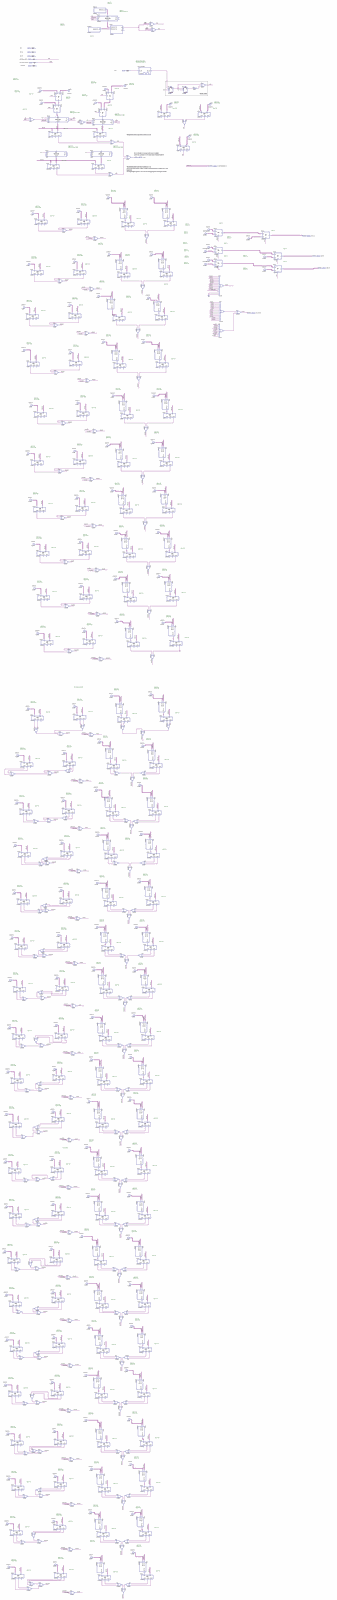
[diagram p0: schematic sheet, whole]
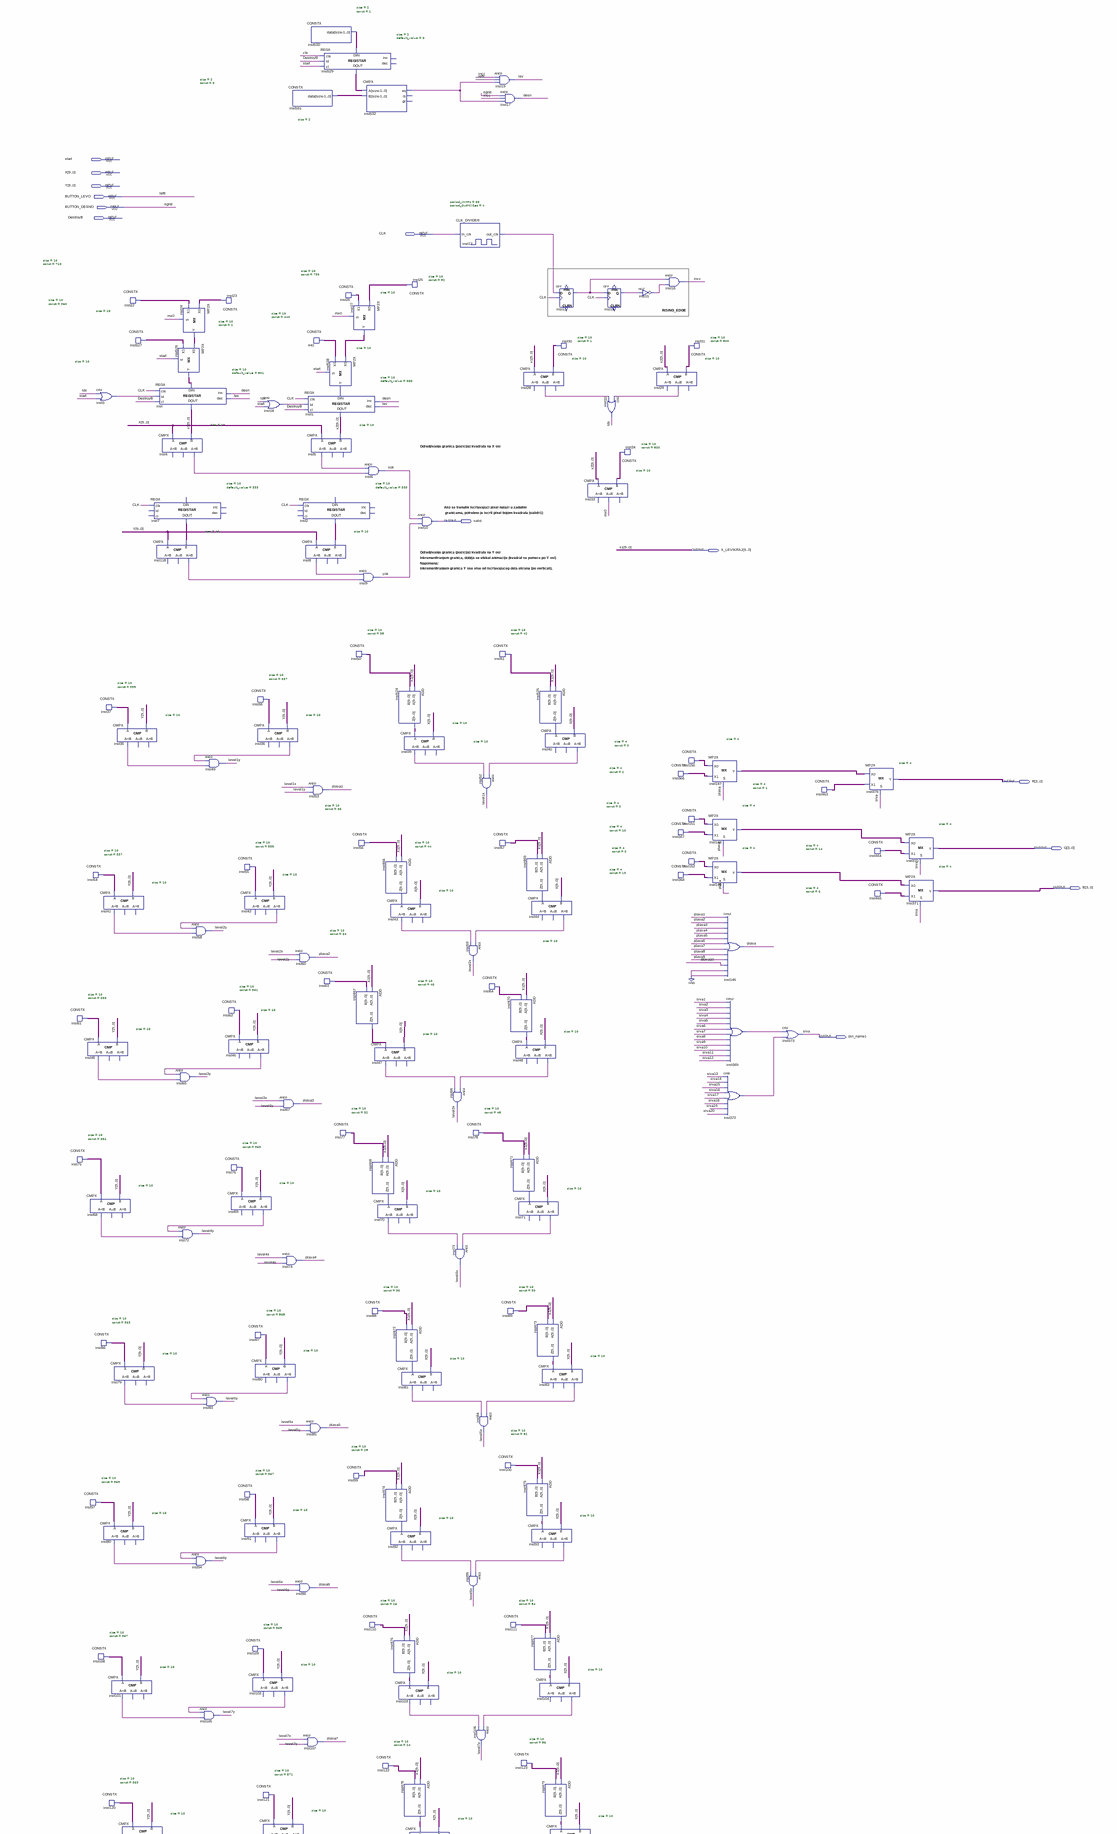
[diagram p1: schematic sheet, upper part]
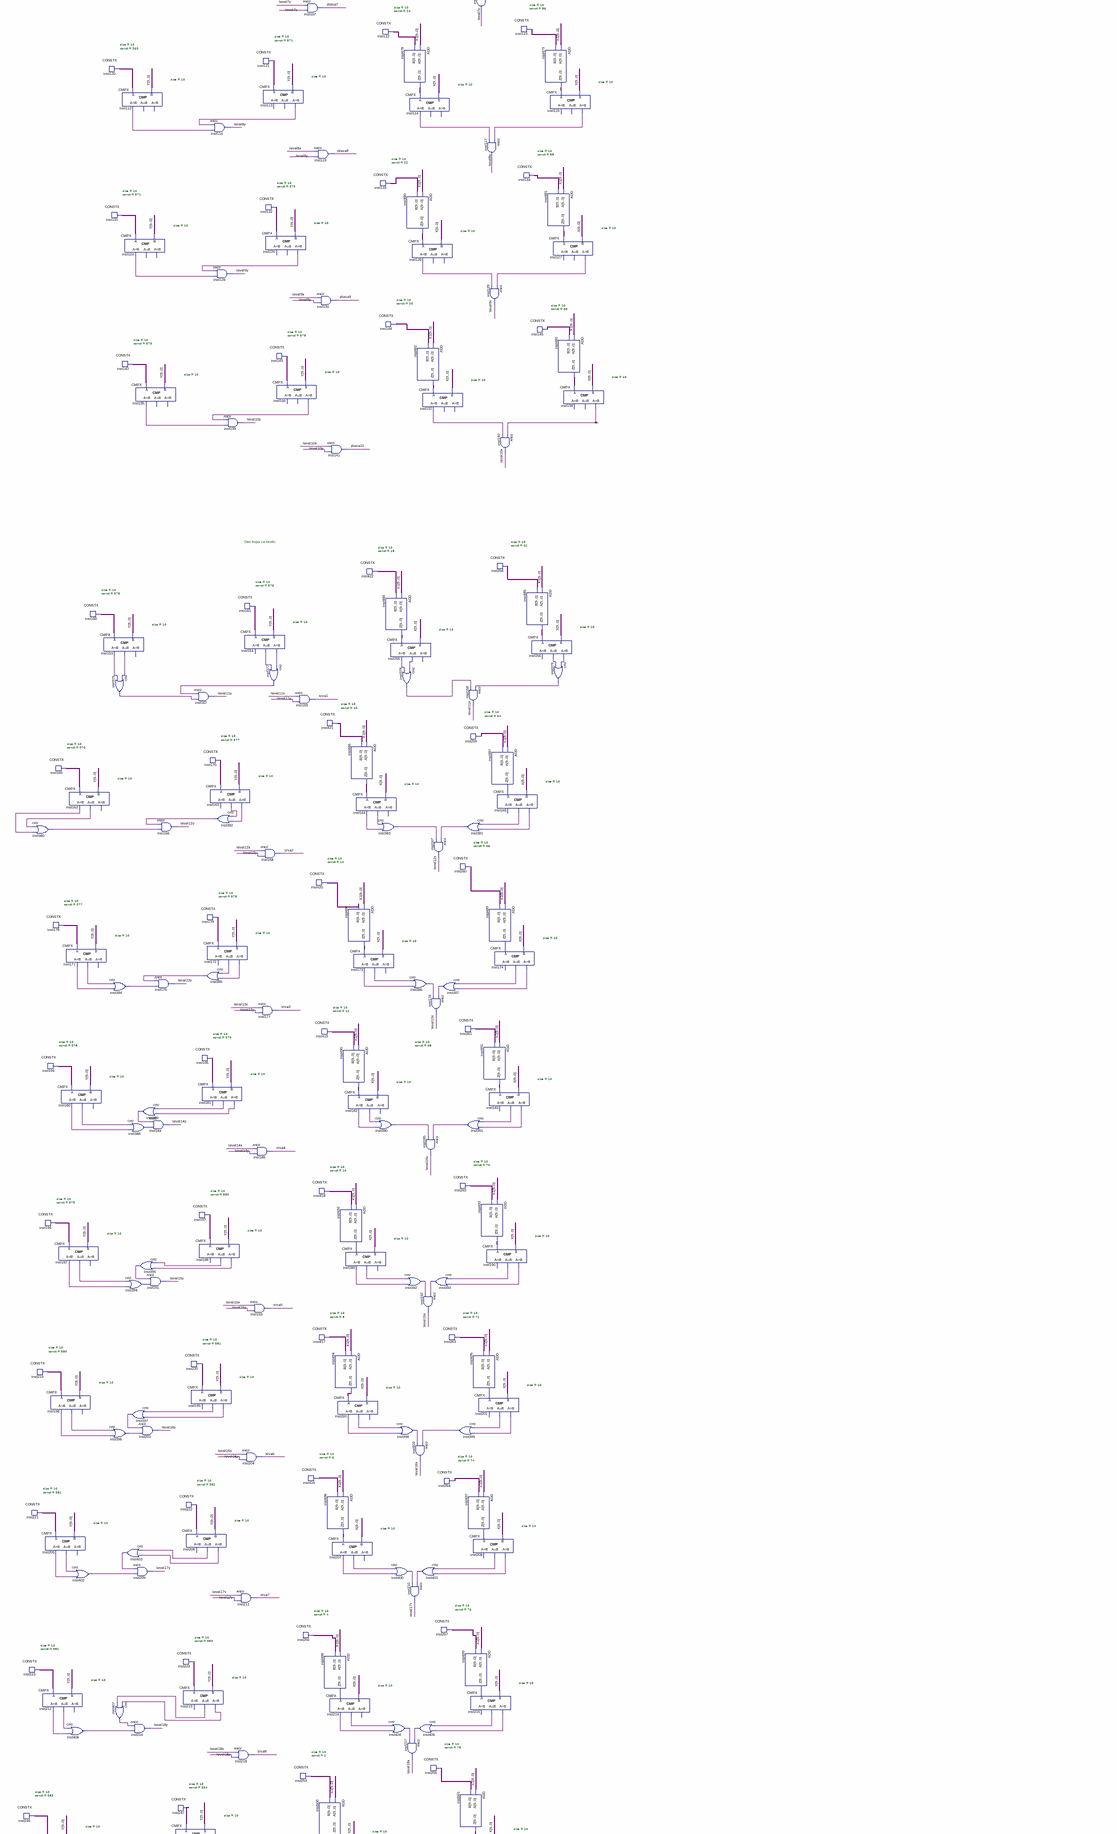
[diagram p2: schematic sheet, middle part]
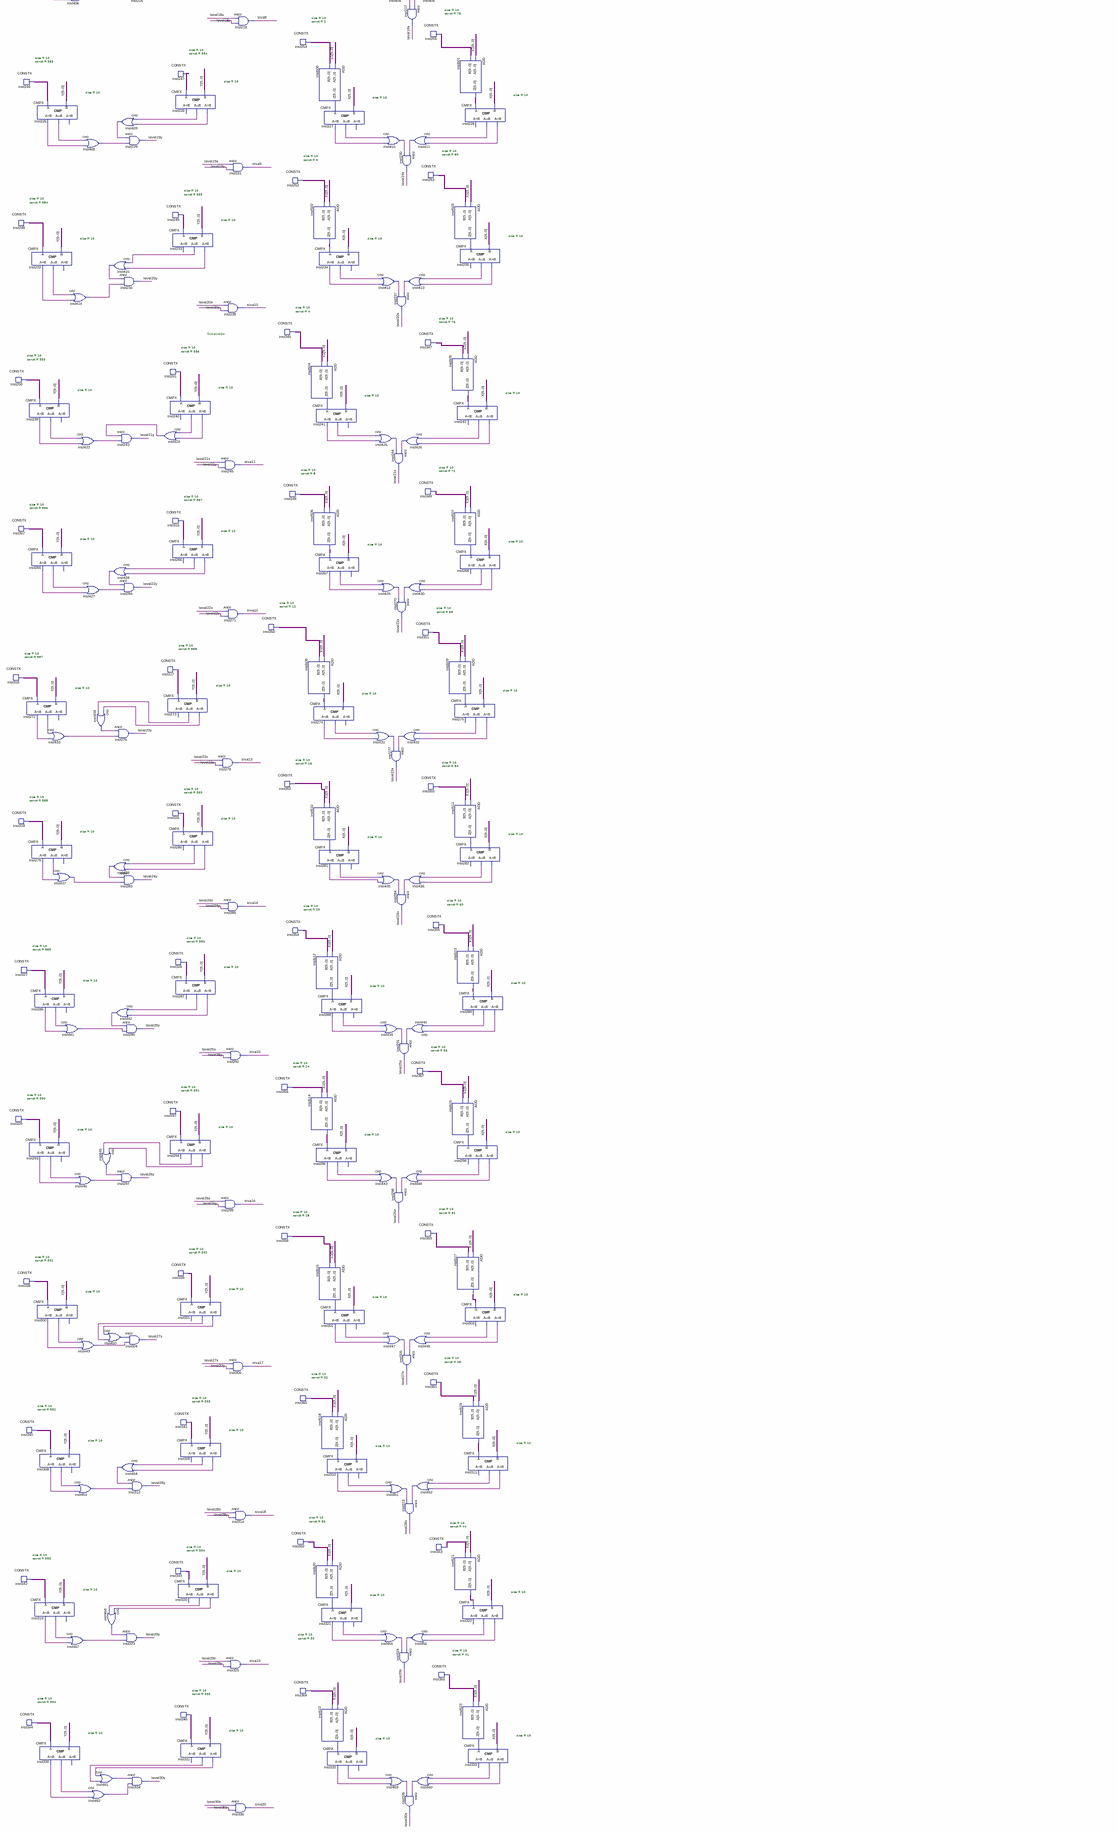
[diagram p3: schematic sheet, lower part]
// Quartus schematic Brod.bdf as structural Verilog: 530 symbols, 13 pins
module Brod (
  input  start,
  input  [9:0] X,
  input  [9:0] Y,
  input  BUTTON_LEVO,
  input  BUTTON_DESNO,
  input  DestroyB,
  input  CLK,
  output valid,
  output [9:0] X_LEVIKRAJ,
  output [3:0] R,
  output [3:0] G,
  output [3:0] B,
  output pin_name1
);

  wire desn, incc, inst3_out, inst4_gr, inst5_ls, inst8_ls, inst12_out_clk, inst13_q, inst14_q, inst15_out,
       inst18_out, inst28_eq, inst29_eq, inst35_ls, inst36_gr, inst39_ls, inst40_gr, inst41_ls, inst42_gr,
       inst43_ls, inst44_gr, inst45_ls, inst46_gr, inst47_ls, inst48_gr, inst68_ls, inst69_gr, inst70_ls,
       inst71_gr, inst79_ls, inst80_gr, inst81_ls, inst82_gr, inst90_ls, inst91_gr, inst92_ls, inst93_gr,
       inst101_ls, inst102_gr, inst103_ls, inst104_gr, inst112_ls, inst113_gr, inst114_ls, inst115_gr,
       inst118_gr, inst124_ls, inst125_gr, inst126_ls, inst127_gr, inst135_ls, inst136_gr, inst137_ls,
       inst138_gr, inst153_eq, inst153_ls, inst154_eq, inst154_gr, inst155_eq, inst155_ls, inst156_eq,
       inst156_gr, inst162_eq, inst162_ls, inst163_eq, inst163_gr, inst164_eq, inst164_ls, inst165_eq,
       inst165_gr, inst171_eq, inst171_ls, inst172_eq, inst172_gr, inst173_eq, inst173_ls, inst174_eq,
       inst174_gr, inst180_eq, inst180_ls, inst181_eq, inst181_gr, inst182_eq, inst182_ls, inst183_eq,
       inst183_gr, inst187_eq, inst187_ls, inst188_eq, inst188_gr, inst189_eq, inst189_ls, inst190_eq,
       inst190_gr, inst198_eq, inst198_ls, inst199_eq, inst199_gr, inst200_eq, inst200_ls, inst201_eq,
       inst201_gr, inst205_eq, inst205_ls, inst206_eq, inst206_gr, inst207_eq, inst207_ls, inst208_eq,
       inst208_gr, inst212_eq, inst212_ls, inst213_eq, inst213_gr, inst214_eq, inst214_ls, inst215_eq,
       inst215_gr, inst225_eq, inst225_ls, inst226_eq, inst226_gr, inst227_eq, inst227_ls, inst228_eq,
       inst228_gr, inst232_eq, inst232_ls, inst233_eq, inst233_gr, inst234_eq, inst234_ls, inst235_eq,
       inst235_gr, inst239_eq, inst239_ls, inst240_eq, inst240_gr, inst241_eq, inst241_ls, inst242_eq,
       inst242_gr, inst265_eq, inst265_ls, inst266_eq, inst266_gr, inst267_eq, inst267_ls, inst268_eq,
       inst268_gr, inst272_eq, inst272_ls, inst273_eq, inst273_gr, inst274_eq, inst274_ls, inst275_eq,
       inst275_gr, inst279_eq, inst279_ls, inst280_eq, inst280_gr, inst281_eq, inst281_ls, inst282_eq,
       inst282_gr, inst286_eq, inst286_ls, inst287_eq, inst287_gr, inst288_eq, inst288_ls, inst289_eq,
       inst289_gr, inst293_eq, inst293_ls, inst294_eq, inst294_gr, inst295_eq, inst295_ls, inst296_eq,
       inst296_gr, inst300_eq, inst300_ls, inst301_eq, inst301_gr, inst302_eq, inst302_ls, inst303_eq,
       inst303_gr, inst308_eq, inst308_ls, inst309_eq, inst309_gr, inst310_eq, inst310_ls, inst311_eq,
       inst311_gr, inst319_eq, inst319_ls, inst320_eq, inst320_gr, inst321_eq, inst321_ls, inst322_eq,
       inst322_gr, inst330_eq, inst330_ls, inst331_eq, inst331_gr, inst332_eq, inst332_ls, inst333_eq,
       inst333_gr, inst369_out, inst372_out, inst375_out, inst377_out, inst378_out, inst379_out, inst380_out,
       inst381_out, inst382_out, inst383_out, inst384_out, inst385_out, inst386_out, inst387_out,
       inst388_out, inst389_out, inst390_out, inst391_out, inst392_out, inst393_out, inst394_out,
       inst395_out, inst396_out, inst397_out, inst398_out, inst399_out, inst400_out, inst401_out,
       inst402_out, inst403_out, inst404_out, inst405_out, inst406_out, inst407_out, inst408_out,
       inst409_out, inst410_out, inst411_out, inst412_out, inst413_out, inst414_out, inst415_out,
       inst423_out, inst424_out, inst425_out, inst426_out, inst427_out, inst428_out, inst429_out,
       inst430_out, inst431_out, inst432_out, inst433_out, inst434_out, inst435_out, inst436_out,
       inst437_out, inst438_out, inst439_out, inst440_out, inst441_out, inst442_out, inst443_out,
       inst444_out, inst445_out, inst446_out, inst447_out, inst448_out, inst449_out, inst450_out,
       inst451_out, inst452_out, inst453_out, inst454_out, inst455_out, inst456_out, inst457_out,
       inst458_out, inst459_out, inst460_out, inst461_out, inst462_out, inst532_eq, ldx, lev, level1x,
       level1y, level2x, level2y, level3x, level3y, level4x, level4y, level5x, level5y, level6x, level6y,
       level7x, level7y, level8x, level8y, level9x, level9y, level10x, level10y, level11x, level11y,
       level12x, level12y, level13x, level13y, level14x, level14y, level15x, level15y, level16x, level16y,
       level17x, level17y, level18x, level18y, level19x, level19y, level20x, level20y, level21x, level21y,
       level22x, level22y, level23x, level23y, level24x, level24y, level25x, level25y, level26x, level26y,
       level27x, level27y, level28x, level28y, level29x, level29y, level30x, level30y, mx0, plava, plava1,
       plava2, plava3, plava4, plava5, plava6, plava7, plava8, plava9, plava10, siva1, siva2, siva3, siva4,
       siva5, siva6, siva7, siva8, siva9, siva10, siva11, siva12, siva13, siva14, siva15, siva16, siva17,
       siva18, siva19, siva20, xok, yok;
  wire [1:0] inst529_data_out, inst530_data, inst531_data;
  wire [3:0] inst147_y, inst148_y, inst149_y, inst150_data, inst151_data, inst152_data, inst366_data,
       inst367_data, inst368_data, inst463_data, inst464_data, inst465_data;
  wire [9:0] inst2_data_out, inst7_data_out, inst22_data, inst23_data, inst24_y, inst25_data, inst26_data,
       inst27_y, inst30_data, inst31_data, inst34_data, inst37_data, inst38_data, inst50_data, inst51_data,
       inst54_data, inst55_data, inst56_data, inst57_data, inst61_data, inst62_data, inst63_data,
       inst64_data, inst75_data, inst76_data, inst77_data, inst78_data, inst86_data, inst87_data,
       inst88_data, inst89_data, inst97_data, inst98_data, inst99_data, inst100_data, inst108_data,
       inst109_data, inst110_data, inst111_data, inst120_data, inst121_data, inst122_data, inst123_data,
       inst131_data, inst132_data, inst133_data, inst134_data, inst142_data, inst143_data, inst144_data,
       inst145_data, inst160_data, inst161_data, inst169_data, inst170_data, inst178_data, inst179_data,
       inst194_data, inst195_data, inst196_data, inst197_data, inst219_data, inst220_data, inst221_data,
       inst222_data, inst223_data, inst224_data, inst246_data, inst247_data, inst248_data, inst249_data,
       inst250_data, inst251_data, inst252_data, inst253_data, inst254_data, inst255_data, inst256_data,
       inst257_data, inst258_data, inst259_data, inst260_data, inst261_data, inst262_data, inst263_data,
       inst264_data, inst307_data, inst315_data, inst316_data, inst317_data, inst318_data, inst326_data,
       inst327_data, inst328_data, inst329_data, inst337_data, inst338_data, inst339_data, inst340_data,
       inst341_data, inst342_data, inst343_data, inst344_data, inst345_data, inst346_data, inst347_data,
       inst348_data, inst349_data, inst350_data, inst351_data, inst352_data, inst353_data, inst354_data,
       inst355_data, inst356_data, inst357_data, inst358_data, inst359_data, inst360_data, inst361_data,
       inst362_data, inst363_data, inst364_data, inst365_data, inst416_data, inst417_data, inst418_data,
       inst419_data, inst420_data, inst421_data, inst422_data, inst466_z, inst467_z, inst468_z, inst469_z,
       inst470_z, inst471_z, inst472_z, inst473_z, inst474_z, inst475_z, inst476_z, inst477_z, inst478_z,
       inst479_z, inst480_z, inst481_z, inst482_z, inst483_z, inst484_z, inst485_z, inst486_z, inst487_z,
       inst488_z, inst489_z, inst490_z, inst491_z, inst492_z, inst493_z, inst494_z, inst495_z, inst496_z,
       inst497_z, inst498_z, inst499_z, inst500_z, inst501_z, inst502_z, inst503_z, inst504_z, inst505_z,
       inst506_z, inst507_z, inst508_z, inst509_z, inst510_z, inst511_z, inst512_z, inst513_z, inst514_z,
       inst515_z, inst516_z, inst517_z, inst518_z, inst519_z, inst520_z, inst521_z, inst522_z, inst523_z,
       inst524_z, inst525_z, inst526_y, inst527_data, inst528_y, n440_data, x2;

  CONSTX #(.size(10), .\const (583)) inst246 (.data(inst246_data));
  CONSTX #(.size(10), .\const (584)) inst248 (.data(inst248_data));
  CONSTX #(.size(10), .\const (585)) inst250 (.data(inst250_data));
  CONSTX #(.size(10), .\const (586)) inst307 (.data(inst307_data));
  CONSTX #(.size(10), .\const (587)) inst316 (.data(inst316_data));
  CONSTX #(.size(10), .\const (588)) inst318 (.data(inst318_data));
  CONSTX #(.size(10), .\const (589)) inst327 (.data(inst327_data));
  CONSTX #(.size(10), .\const (590)) inst329 (.data(inst329_data));
  CONSTX #(.size(10), .\const (591)) inst338 (.data(inst338_data));
  CONSTX #(.size(10), .\const (592)) inst340 (.data(inst340_data));
  CONSTX #(.size(10), .\const (593)) inst342 (.data(inst342_data));
  CONSTX #(.size(10), .\const (594)) inst344 (.data(inst344_data));
  or inst380 (inst380_out, inst162_eq, inst162_ls);
  CONSTX #(.size(10), .\const (578)) inst194 (.data(inst194_data));
  CONSTX #(.size(10), .\const (579)) inst196 (.data(inst196_data));
  CONSTX #(.size(10), .\const (580)) inst219 (.data(inst219_data));
  CONSTX #(.size(10), .\const (581)) inst221 (.data(inst221_data));
  CMPX #(.size(10)) inst205 (.A(inst221_data), .B(Y), .ls(inst205_ls), .eq(inst205_eq));  // open: gr
  CONSTX #(.size(10), .\const (582)) inst223 (.data(inst223_data));
  CMPX #(.size(10)) inst212 (.A(inst223_data), .B(Y), .ls(inst212_ls), .eq(inst212_eq));  // open: gr
  CMPX #(.size(10)) inst225 (.A(inst246_data), .B(Y), .ls(inst225_ls), .eq(inst225_eq));  // open: gr
  CMPX #(.size(10)) inst232 (.A(inst248_data), .B(Y), .ls(inst232_ls), .eq(inst232_eq));  // open: gr
  CMPX #(.size(10)) inst239 (.A(inst250_data), .B(Y), .ls(inst239_ls), .eq(inst239_eq));  // open: gr
  CMPX #(.size(10)) inst265 (.A(inst307_data), .B(Y), .ls(inst265_ls), .eq(inst265_eq));  // open: gr
  CMPX #(.size(10)) inst272 (.A(inst316_data), .B(Y), .ls(inst272_ls), .eq(inst272_eq));  // open: gr
  CMPX #(.size(10)) inst279 (.A(inst318_data), .B(Y), .ls(inst279_ls), .eq(inst279_eq));  // open: gr
  CMPX #(.size(10)) inst286 (.A(inst327_data), .B(Y), .ls(inst286_ls), .eq(inst286_eq));  // open: gr
  CMPX #(.size(10)) inst293 (.A(inst329_data), .B(Y), .ls(inst293_ls), .eq(inst293_eq));  // open: gr
  CMPX #(.size(10)) inst300 (.A(inst338_data), .B(Y), .ls(inst300_ls), .eq(inst300_eq));  // open: gr
  CMPX #(.size(10)) inst308 (.A(inst340_data), .B(Y), .ls(inst308_ls), .eq(inst308_eq));  // open: gr
  CMPX #(.size(10)) inst319 (.A(inst342_data), .B(Y), .ls(inst319_ls), .eq(inst319_eq));  // open: gr
  CMPX #(.size(10)) inst330 (.A(inst344_data), .B(Y), .ls(inst330_ls), .eq(inst330_eq));  // open: gr
  CONSTX #(.size(10), .\const (576)) inst169 (.data(inst169_data));
  CONSTX #(.size(10), .\const (577)) inst178 (.data(inst178_data));
  CMPX #(.size(10)) inst171 (.A(inst178_data), .B(Y), .ls(inst171_ls), .eq(inst171_eq));  // open: gr
  CMPX #(.size(10)) inst180 (.A(inst194_data), .B(Y), .ls(inst180_ls), .eq(inst180_eq));  // open: gr
  CMPX #(.size(10)) inst187 (.A(inst196_data), .B(Y), .ls(inst187_ls), .eq(inst187_eq));  // open: gr
  CMPX #(.size(10)) inst198 (.A(inst219_data), .B(Y), .ls(inst198_ls), .eq(inst198_eq));  // open: gr
  or inst433 (inst433_out, inst272_eq, inst272_ls);
  or inst437 (inst437_out, inst279_eq, inst279_ls);
  or inst441 (inst441_out, inst286_eq, inst286_ls);
  CONSTX #(.size(10), .\const (559)) inst61 (.data(inst61_data));
  CMPX #(.size(10)) inst45 (.A(inst61_data), .B(Y), .ls(inst45_ls));  // open: eq, gr
  CONSTX #(.size(10), .\const (561)) inst75 (.data(inst75_data));
  CONSTX #(.size(10), .\const (565)) inst97 (.data(inst97_data));
  CONSTX #(.size(10), .\const (575)) inst160 (.data(inst160_data));
  CMPX #(.size(10)) inst162 (.A(inst169_data), .B(Y), .ls(inst162_ls), .eq(inst162_eq));  // open: gr
  or inst402 (inst402_out, inst205_eq, inst205_ls);
  or inst406 (inst406_out, inst212_eq, inst212_ls);
  or inst408 (inst408_out, inst225_eq, inst225_ls);
  or inst414 (inst414_out, inst232_eq, inst232_ls);
  or inst423 (inst423_out, inst239_eq, inst239_ls);
  or inst427 (inst427_out, inst265_eq, inst265_ls);
  or inst446 (inst446_out, inst293_eq, inst293_ls);
  or inst449 (inst449_out, inst300_eq, inst300_ls);
  or inst453 (inst453_out, inst308_eq, inst308_ls);
  or inst457 (inst457_out, inst319_eq, inst319_ls);
  or inst3 (inst3_out, ldx, start);
  CONSTX #(.size(10), .\const (555)) inst37 (.data(inst37_data));
  CONSTX #(.size(10), .\const (557)) inst54 (.data(inst54_data));
  CMPX #(.size(10)) inst41 (.A(inst54_data), .B(Y), .ls(inst41_ls));  // open: eq, gr
  CMPX #(.size(10)) inst68 (.A(inst75_data), .B(Y), .ls(inst68_ls));  // open: eq, gr
  CONSTX #(.size(10), .\const (563)) inst86 (.data(inst86_data));
  CMPX #(.size(10)) inst90 (.A(inst97_data), .B(Y), .ls(inst90_ls));  // open: eq, gr
  CONSTX #(.size(10), .\const (567)) inst108 (.data(inst108_data));
  CONSTX #(.size(10), .\const (569)) inst120 (.data(inst120_data));
  CONSTX #(.size(10), .\const (571)) inst131 (.data(inst131_data));
  CMPX #(.size(10)) inst153 (.A(inst160_data), .B(Y), .ls(inst153_ls), .eq(inst153_eq));  // open: gr
  or inst434 (inst434_out, inst273_gr, inst273_eq);
  or inst445 (inst445_out, inst294_gr, inst294_eq);
  or inst450 (inst450_out, inst301_gr, inst301_eq);
  or inst458 (inst458_out, inst320_gr, inst320_eq);
  or inst461 (inst461_out, inst331_gr, inst331_eq);
  or inst462 (inst462_out, inst330_eq, inst330_ls);
  CONSTX #(.size(10), .\const (719)) inst22 (.data(inst22_data));
  CMPX #(.size(10)) inst35 (.A(inst37_data), .B(Y), .ls(inst35_ls));  // open: eq, gr
  CMPX #(.size(10)) inst79 (.A(inst86_data), .B(Y), .ls(inst79_ls));  // open: eq, gr
  CMPX #(.size(10)) inst101 (.A(inst108_data), .B(Y), .ls(inst101_ls));  // open: eq, gr
  CMPX #(.size(10)) inst112 (.A(inst120_data), .B(Y), .ls(inst112_ls));  // open: eq, gr
  CMPX #(.size(10)) inst124 (.A(inst131_data), .B(Y), .ls(inst124_ls));  // open: eq, gr
  CONSTX #(.size(10), .\const (573)) inst142 (.data(inst142_data));
  or inst375 (inst375_out, inst153_eq, inst153_ls);
  or inst384 (inst384_out, inst171_eq, inst171_ls);
  or inst394 (inst394_out, inst187_eq, inst187_ls);
  or inst396 (inst396_out, inst198_eq, inst198_ls);
  or inst403 (inst403_out, inst206_eq, inst206_gr);
  or inst407 (inst407_out, inst213_gr, inst213_eq);
  or inst409 (inst409_out, inst226_eq, inst226_gr);
  and inst229 (level19y, inst409_out, inst408_out);
  or inst415 (inst415_out, inst233_eq, inst233_gr);
  and inst236 (level20y, inst415_out, inst414_out);
  and inst243 (level21y, inst424_out, inst423_out);
  or inst428 (inst428_out, inst266_eq, inst266_gr);
  and inst269 (level22y, inst428_out, inst427_out);
  and inst276 (level23y, inst434_out, inst433_out);
  or inst438 (inst438_out, inst280_eq, inst280_gr);
  and inst283 (level24y, inst438_out, inst437_out);
  or inst442 (inst442_out, inst287_eq, inst287_gr);
  and inst290 (level25y, inst442_out, inst441_out);
  and inst297 (level26y, inst445_out, inst446_out);
  and inst304 (level27y, inst450_out, inst449_out);
  or inst454 (inst454_out, inst309_eq, inst309_gr);
  and inst323 (level29y, inst458_out, inst457_out);
  CONSTX #(.size(10), .\const (360)) inst527 (.data(inst527_data));
  CMPX #(.size(10)) inst135 (.A(inst142_data), .B(Y), .ls(inst135_ls));  // open: eq, gr
  or inst389 (inst389_out, inst181_eq, inst181_gr);
  or inst388 (inst388_out, inst180_eq, inst180_ls);
  or inst395 (inst395_out, inst188_eq, inst188_gr);
  and inst191 (level15y, inst395_out, inst394_out);
  or inst397 (inst397_out, inst199_eq, inst199_gr);
  and inst202 (level16y, inst397_out, inst396_out);
  and inst209 (level17y, inst403_out, inst402_out);
  and inst216 (level18y, inst407_out, inst406_out);
  and inst312 (level28y, inst454_out, inst453_out);
  and inst334 (level30y, inst461_out, inst462_out);
  REGX #(.size(10), .default_value(801)) inst (
    .clk(CLK), .ld(inst3_out), .cl(DestroyB), .inc(desn), .dec(lev), .data_in(inst526_y),
    .data_out(X_LEVIKRAJ));
  CMPX #(.size(10)) inst4 (.A(X), .B(X_LEVIKRAJ), .gr(inst4_gr));  // open: ls, eq
  REGX #(.size(10), .default_value(555)) inst7 (
    .clk(CLK), .data_out(inst7_data_out));  // open: ld, cl, inc, dec, data_in
  CMPX #(.size(10)) inst118 (.A(Y), .B(inst7_data_out), .gr(inst118_gr));  // open: ls, eq
  and inst166 (level12y, inst382_out, inst380_out);
  and inst175 (level13y, inst385_out, inst384_out);
  and inst184 (level14y, inst389_out, inst388_out);
  CONSTX #(.size(10), .\const (585)) inst249 (.data(inst249_data));
  CMPX #(.size(10)) inst233 (.A(inst249_data), .B(Y), .eq(inst233_eq), .gr(inst233_gr));  // open: ls
  CONSTX #(.size(10), .\const (586)) inst251 (.data(inst251_data));
  CMPX #(.size(10)) inst240 (.A(inst251_data), .B(Y), .eq(inst240_eq), .gr(inst240_gr));  // open: ls
  or inst424 (inst424_out, inst240_eq, inst240_gr);
  CONSTX #(.size(10), .\const (587)) inst315 (.data(inst315_data));
  CMPX #(.size(10)) inst266 (.A(inst315_data), .B(Y), .eq(inst266_eq), .gr(inst266_gr));  // open: ls
  CONSTX #(.size(10), .\const (588)) inst317 (.data(inst317_data));
  CMPX #(.size(10)) inst273 (.A(inst317_data), .B(Y), .eq(inst273_eq), .gr(inst273_gr));  // open: ls
  CONSTX #(.size(10), .\const (589)) inst326 (.data(inst326_data));
  CMPX #(.size(10)) inst280 (.A(inst326_data), .B(Y), .eq(inst280_eq), .gr(inst280_gr));  // open: ls
  CONSTX #(.size(10), .\const (590)) inst328 (.data(inst328_data));
  CONSTX #(.size(10), .\const (591)) inst337 (.data(inst337_data));
  CMPX #(.size(10)) inst294 (.A(inst337_data), .B(Y), .eq(inst294_eq), .gr(inst294_gr));  // open: ls
  CONSTX #(.size(10), .\const (594)) inst343 (.data(inst343_data));
  MP2X #(.size(10)) inst24 (.S(mx0), .X0(inst23_data), .X1(inst22_data), .Y(inst24_y));
  MP2X #(.size(10)) inst526 (.S(start), .X0(inst24_y), .X1(inst527_data), .Y(inst526_y));
  and inst65 (level3y, inst46_gr, inst45_ls);
  and inst72 (level4y, inst69_gr, inst68_ls);
  CONSTX #(.size(10), .\const (581)) inst220 (.data(inst220_data));
  CMPX #(.size(10)) inst199 (.A(inst220_data), .B(Y), .eq(inst199_eq), .gr(inst199_gr));  // open: ls
  CONSTX #(.size(10), .\const (582)) inst222 (.data(inst222_data));
  CMPX #(.size(10)) inst206 (.A(inst222_data), .B(Y), .eq(inst206_eq), .gr(inst206_gr));  // open: ls
  CONSTX #(.size(10), .\const (583)) inst224 (.data(inst224_data));
  CMPX #(.size(10)) inst213 (.A(inst224_data), .B(Y), .eq(inst213_eq), .gr(inst213_gr));  // open: ls
  CONSTX #(.size(10), .\const (584)) inst247 (.data(inst247_data));
  CMPX #(.size(10)) inst226 (.A(inst247_data), .B(Y), .eq(inst226_eq), .gr(inst226_gr));  // open: ls
  CMPX #(.size(10)) inst287 (.A(inst328_data), .B(Y), .eq(inst287_eq), .gr(inst287_gr));  // open: ls
  CONSTX #(.size(10), .\const (592)) inst339 (.data(inst339_data));
  CMPX #(.size(10)) inst301 (.A(inst339_data), .B(Y), .eq(inst301_eq), .gr(inst301_gr));  // open: ls
  CONSTX #(.size(10), .\const (593)) inst341 (.data(inst341_data));
  CMPX #(.size(10)) inst309 (.A(inst341_data), .B(Y), .eq(inst309_eq), .gr(inst309_gr));  // open: ls
  CMPX #(.size(10)) inst320 (.A(inst343_data), .B(Y), .eq(inst320_eq), .gr(inst320_gr));  // open: ls
  CONSTX #(.size(10), .\const (595)) inst345 (.data(inst345_data));
  CMPX #(.size(10)) inst331 (.A(inst345_data), .B(Y), .eq(inst331_eq), .gr(inst331_gr));  // open: ls
  and inst49 (level1y, inst36_gr, inst35_ls);
  and inst58 (level2y, inst42_gr, inst41_ls);
  and inst83 (level5y, inst80_gr, inst79_ls);
  and inst94 (level6y, inst91_gr, inst90_ls);
  and inst105 (level7y, inst102_gr, inst101_ls);
  and inst116 (level8y, inst113_gr, inst112_ls);
  and inst157 (level11y, inst377_out, inst375_out);
  CONSTX #(.size(10), .\const (577)) inst170 (.data(inst170_data));
  CMPX #(.size(10)) inst163 (.A(inst170_data), .B(Y), .eq(inst163_eq), .gr(inst163_gr));  // open: ls
  CONSTX #(.size(10), .\const (578)) inst179 (.data(inst179_data));
  CMPX #(.size(10)) inst172 (.A(inst179_data), .B(Y), .eq(inst172_eq), .gr(inst172_gr));  // open: ls
  or inst385 (inst385_out, inst172_eq, inst172_gr);
  CONSTX #(.size(10), .\const (579)) inst195 (.data(inst195_data));
  CMPX #(.size(10)) inst181 (.A(inst195_data), .B(Y), .eq(inst181_eq), .gr(inst181_gr));  // open: ls
  CONSTX #(.size(10), .\const (580)) inst197 (.data(inst197_data));
  CMPX #(.size(10)) inst188 (.A(inst197_data), .B(Y), .eq(inst188_eq), .gr(inst188_gr));  // open: ls
  CONSTX #(.size(10), .\const (2)) inst23 (.data(inst23_data));
  CONSTX #(.size(10), .\const (561)) inst62 (.data(inst62_data));
  CMPX #(.size(10)) inst46 (.A(inst62_data), .B(Y), .gr(inst46_gr));  // open: ls, eq
  CONSTX #(.size(10), .\const (563)) inst76 (.data(inst76_data));
  CMPX #(.size(10)) inst69 (.A(inst76_data), .B(Y), .gr(inst69_gr));  // open: ls, eq
  and inst128 (level9y, inst125_gr, inst124_ls);
  and inst139 (level10y, inst136_gr, inst135_ls);
  or inst382 (inst382_out, inst163_eq, inst163_gr);
  and inst231 (siva9, level19x, level19y);
  and inst238 (siva10, level20x, level20y);
  and inst245 (siva11, level21x, level21y);
  and inst271 (siva12, level22x, level22y);
  and inst278 (siva13, level23x, level23y);
  and inst285 (siva14, level24x, level24y);
  and inst292 (siva15, level25x, level25y);
  and inst299 (siva16, level26x, level26y);
  and inst306 (siva17, level27x, level27y);
  and inst314 (siva18, level28x, level28y);
  and inst325 (siva19, level29x, level29y);
  and inst336 (siva20, level30x, level30y);
  CONSTX #(.size(10), .\const (557)) inst38 (.data(inst38_data));
  CMPX #(.size(10)) inst36 (.A(inst38_data), .B(Y), .gr(inst36_gr));  // open: ls, eq
  CONSTX #(.size(10), .\const (559)) inst55 (.data(inst55_data));
  CMPX #(.size(10)) inst42 (.A(inst55_data), .B(Y), .gr(inst42_gr));  // open: ls, eq
  CONSTX #(.size(10), .\const (565)) inst87 (.data(inst87_data));
  CMPX #(.size(10)) inst80 (.A(inst87_data), .B(Y), .gr(inst80_gr));  // open: ls, eq
  CONSTX #(.size(10), .\const (567)) inst98 (.data(inst98_data));
  CMPX #(.size(10)) inst91 (.A(inst98_data), .B(Y), .gr(inst91_gr));  // open: ls, eq
  CONSTX #(.size(10), .\const (569)) inst109 (.data(inst109_data));
  CMPX #(.size(10)) inst102 (.A(inst109_data), .B(Y), .gr(inst102_gr));  // open: ls, eq
  CONSTX #(.size(10), .\const (576)) inst161 (.data(inst161_data));
  CMPX #(.size(10)) inst154 (.A(inst161_data), .B(Y), .eq(inst154_eq), .gr(inst154_gr));  // open: ls
  and inst186 (siva4, level14x, level14y);
  and inst193 (siva5, level15x, level15y);
  and inst204 (siva6, level16x, level16y);
  and inst211 (siva7, level17x, level17y);
  and inst218 (siva8, level18x, level18y);
  or inst18 (inst18_out, ldx, start);
  CONSTX #(.size(10), .\const (571)) inst121 (.data(inst121_data));
  CMPX #(.size(10)) inst113 (.A(inst121_data), .B(Y), .gr(inst113_gr));  // open: ls, eq
  CONSTX #(.size(10), .\const (573)) inst132 (.data(inst132_data));
  CMPX #(.size(10)) inst125 (.A(inst132_data), .B(Y), .gr(inst125_gr));  // open: ls, eq
  CONSTX #(.size(10), .\const (575)) inst143 (.data(inst143_data));
  CMPX #(.size(10)) inst136 (.A(inst143_data), .B(Y), .gr(inst136_gr));  // open: ls, eq
  or inst377 (inst377_out, inst154_gr, inst154_eq);
  and inst168 (siva2, level12x, level12y);
  and inst177 (siva3, level13x, level13y);
  CONSTX #(.size(10), .\const (12)) inst350 (.data(inst350_data));
  CONSTX #(.size(10), .\const (24)) inst356 (.data(inst356_data));
  CONSTX #(.size(10), .\const (28)) inst358 (.data(inst358_data));
  CONSTX #(.size(2), .\const (0)) inst531 (.data(inst531_data));
  and inst60 (plava2, level2x, level2y);
  and inst67 (plava3, level3x, level3y);
  and inst74 (plava4, level4x, level4y);
  and inst96 (plava6, level6x, level6y);
  and inst159 (siva1, level11x, level11y);
  CONSTX #(.size(10), .\const (4)) inst256 (.data(inst256_data));
  CONSTX #(.size(10), .\const (2)) inst254 (.data(inst254_data));
  CONSTX #(.size(10), .\const (0)) inst252 (.data(inst252_data));
  CONSTX #(.size(10), .\const (4)) inst346 (.data(inst346_data));
  CONSTX #(.size(10), .\const (8)) inst348 (.data(inst348_data));
  CONSTX #(.size(10), .\const (16)) inst352 (.data(inst352_data));
  CONSTX #(.size(10), .\const (20)) inst354 (.data(inst354_data));
  CONSTX #(.size(10), .\const (32)) inst360 (.data(inst360_data));
  CONSTX #(.size(10), .\const (36)) inst362 (.data(inst362_data));
  CONSTX #(.size(10), .\const (39)) inst364 (.data(inst364_data));
  CONSTX #(.size(2), .\const (1)) inst530 (.data(inst530_data));
  CONSTX #(.size(10), .\const (440)) u_440 (.data(n440_data));
  REGX #(.size(10), .default_value(880)) inst1 (
    .clk(CLK), .ld(inst18_out), .cl(DestroyB), .inc(desn), .dec(lev), .data_in(inst528_y), .data_out(x2));
  CMPX #(.size(10)) inst5 (.A(X), .B(x2), .ls(inst5_ls));  // open: eq, gr
  REGX #(.size(10), .default_value(595)) inst2 (
    .clk(CLK), .data_out(inst2_data_out));  // open: ld, cl, inc, dec, data_in
  CMPX #(.size(10)) inst8 (.A(Y), .B(inst2_data_out), .ls(inst8_ls));  // open: eq, gr
  and inst53 (plava1, level1x, level1y);
  CONSTX #(.size(10), .\const (34)) inst63 (.data(inst63_data));
  and inst85 (plava5, level5x, level5y);
  and inst107 (plava7, level7x, level7y);
  and inst119 (plava8, level8x, level8y);
  and inst130 (plava9, level9x, level9y);
  CONSTX #(.size(10), .\const (14)) inst420 (.data(inst420_data));
  CONSTX #(.size(10), .\const (12)) inst419 (.data(inst419_data));
  CONSTX #(.size(10), .\const (10)) inst418 (.data(inst418_data));
  CONSTX #(.size(10), .\const (8)) inst417 (.data(inst417_data));
  CONSTX #(.size(10), .\const (6)) inst416 (.data(inst416_data));
  ADD inst500 (.A(X_LEVIKRAJ), .B(inst254_data), .Z(inst500_z));
  ADD inst502 (.A(X_LEVIKRAJ), .B(inst252_data), .Z(inst502_z));
  CMPX #(.size(10)) inst234 (.A(inst502_z), .B(X), .ls(inst234_ls), .eq(inst234_eq));  // open: gr
  ADD inst504 (.A(X_LEVIKRAJ), .B(inst346_data), .Z(inst504_z));
  CMPX #(.size(10)) inst241 (.A(inst504_z), .B(X), .ls(inst241_ls), .eq(inst241_eq));  // open: gr
  ADD inst506 (.A(X_LEVIKRAJ), .B(inst348_data), .Z(inst506_z));
  CMPX #(.size(10)) inst267 (.A(inst506_z), .B(X), .ls(inst267_ls), .eq(inst267_eq));  // open: gr
  ADD inst508 (.A(X_LEVIKRAJ), .B(inst350_data), .Z(inst508_z));
  CMPX #(.size(10)) inst274 (.A(inst508_z), .B(X), .ls(inst274_ls), .eq(inst274_eq));  // open: gr
  ADD inst510 (.A(X_LEVIKRAJ), .B(inst352_data), .Z(inst510_z));
  CMPX #(.size(10)) inst281 (.A(inst510_z), .B(X), .ls(inst281_ls), .eq(inst281_eq));  // open: gr
  ADD inst512 (.A(X_LEVIKRAJ), .B(inst354_data), .Z(inst512_z));
  CMPX #(.size(10)) inst288 (.A(inst512_z), .B(X), .ls(inst288_ls), .eq(inst288_eq));  // open: gr
  ADD inst514 (.A(X_LEVIKRAJ), .B(inst356_data), .Z(inst514_z));
  CMPX #(.size(10)) inst295 (.A(inst514_z), .B(X), .ls(inst295_ls), .eq(inst295_eq));  // open: gr
  ADD inst516 (.A(X_LEVIKRAJ), .B(inst358_data), .Z(inst516_z));
  ADD inst518 (.A(X_LEVIKRAJ), .B(inst360_data), .Z(inst518_z));
  ADD inst520 (.A(X_LEVIKRAJ), .B(inst362_data), .Z(inst520_z));
  CMPX #(.size(10)) inst321 (.A(inst520_z), .B(X), .ls(inst321_ls), .eq(inst321_eq));  // open: gr
  ADD inst522 (.A(X_LEVIKRAJ), .B(inst364_data), .Z(inst522_z));
  REGX #(.size(2), .default_value(0)) inst529 (
    .clk(CLK), .ld(DestroyB), .cl(start), .data_in(inst530_data), .data_out(inst529_data_out));  // open: inc, dec
  CONSTX #(.size(10), .\const (799)) inst26 (.data(inst26_data));
  MP2X #(.size(10)) inst528 (.S(start), .X0(inst27_y), .X1(n440_data), .Y(inst528_y));
  CONSTX #(.size(10), .\const (32)) inst77 (.data(inst77_data));
  and inst141 (plava10, level10x, level10y);
  CONSTX #(.size(10), .\const (16)) inst421 (.data(inst421_data));
  ADD inst490 (.A(X_LEVIKRAJ), .B(inst419_data), .Z(inst490_z));
  ADD inst492 (.A(X_LEVIKRAJ), .B(inst418_data), .Z(inst492_z));
  ADD inst494 (.A(X_LEVIKRAJ), .B(inst417_data), .Z(inst494_z));
  CMPX #(.size(10)) inst200 (.A(inst494_z), .B(X), .ls(inst200_ls), .eq(inst200_eq));  // open: gr
  ADD inst496 (.A(X_LEVIKRAJ), .B(inst416_data), .Z(inst496_z));
  CMPX #(.size(10)) inst207 (.A(inst496_z), .B(X), .ls(inst207_ls), .eq(inst207_eq));  // open: gr
  ADD inst498 (.A(X_LEVIKRAJ), .B(inst256_data), .Z(inst498_z));
  CMPX #(.size(10)) inst214 (.A(inst498_z), .B(X), .ls(inst214_ls), .eq(inst214_eq));  // open: gr
  CMPX #(.size(10)) inst227 (.A(inst500_z), .B(X), .ls(inst227_ls), .eq(inst227_eq));  // open: gr
  CMPX #(.size(10)) inst302 (.A(inst516_z), .B(X), .ls(inst302_ls), .eq(inst302_eq));  // open: gr
  CMPX #(.size(10)) inst310 (.A(inst518_z), .B(X), .ls(inst310_ls), .eq(inst310_eq));  // open: gr
  CMPX #(.size(10)) inst332 (.A(inst522_z), .B(X), .ls(inst332_ls), .eq(inst332_eq));  // open: gr
  MP2X #(.size(10)) inst27 (.S(mx0), .X0(inst25_data), .X1(inst26_data), .Y(inst27_y));
  and inst9 (yok, inst8_ls, inst118_gr);
  CONSTX #(.size(10), .\const (38)) inst50 (.data(inst50_data));
  CONSTX #(.size(10), .\const (36)) inst56 (.data(inst56_data));
  ADD inst467 (.A(X_LEVIKRAJ), .B(inst63_data), .Z(inst467_z));
  CONSTX #(.size(10), .\const (28)) inst99 (.data(inst99_data));
  CONSTX #(.size(10), .\const (18)) inst422 (.data(inst422_data));
  ADD inst486 (.A(X_LEVIKRAJ), .B(inst421_data), .Z(inst486_z));
  CMPX #(.size(10)) inst164 (.A(inst486_z), .B(X), .ls(inst164_ls), .eq(inst164_eq));  // open: gr
  ADD inst488 (.A(X_LEVIKRAJ), .B(inst420_data), .Z(inst488_z));
  CMPX #(.size(10)) inst173 (.A(inst488_z), .B(X), .ls(inst173_ls), .eq(inst173_eq));  // open: gr
  CMPX #(.size(10)) inst182 (.A(inst490_z), .B(X), .ls(inst182_ls), .eq(inst182_eq));  // open: gr
  CMPX #(.size(10)) inst189 (.A(inst492_z), .B(X), .ls(inst189_ls), .eq(inst189_eq));  // open: gr
  CMPX #(.size(2)) inst532 (.A(inst529_data_out), .B(inst531_data), .eq(inst532_eq));  // open: ls, gr
  and inst6 (xok, inst5_ls, inst4_gr);
  ADD inst466 (.A(X_LEVIKRAJ), .B(inst56_data), .Z(inst466_z));
  CMPX #(.size(10)) inst47 (.A(inst467_z), .B(X), .ls(inst47_ls));  // open: eq, gr
  ADD inst468 (.A(X_LEVIKRAJ), .B(inst77_data), .Z(inst468_z));
  CMPX #(.size(10)) inst70 (.A(inst468_z), .B(X), .ls(inst70_ls));  // open: eq, gr
  CONSTX #(.size(10), .\const (30)) inst88 (.data(inst88_data));
  ADD inst474 (.A(X_LEVIKRAJ), .B(inst99_data), .Z(inst474_z));
  CONSTX #(.size(10), .\const (26)) inst110 (.data(inst110_data));
  CONSTX #(.size(10), .\const (24)) inst122 (.data(inst122_data));
  CONSTX #(.size(10), .\const (22)) inst133 (.data(inst133_data));
  CONSTX #(.size(10), .\const (20)) inst144 (.data(inst144_data));
  ADD inst484 (.A(X_LEVIKRAJ), .B(inst422_data), .Z(inst484_z));
  or inst383 (inst383_out, inst164_eq, inst164_ls);
  or inst390 (inst390_out, inst182_eq, inst182_ls);
  or inst412 (inst412_out, inst234_eq, inst234_ls);
  or inst425 (inst425_out, inst241_eq, inst241_ls);
  or inst429 (inst429_out, inst267_eq, inst267_ls);
  or inst431 (inst431_out, inst274_eq, inst274_ls);
  or inst435 (inst435_out, inst281_eq, inst281_ls);
  or inst439 (inst439_out, inst288_eq, inst288_ls);
  or inst443 (inst443_out, inst295_eq, inst295_ls);
  or inst455 (inst455_out, inst321_eq, inst321_ls);
  ADD inst524 (.A(X_LEVIKRAJ), .B(inst50_data), .Z(inst524_z));
  CMPX #(.size(10)) inst39 (.A(inst524_z), .B(X), .ls(inst39_ls));  // open: eq, gr
  CMPX #(.size(10)) inst43 (.A(inst466_z), .B(X), .ls(inst43_ls));  // open: eq, gr
  ADD inst472 (.A(X_LEVIKRAJ), .B(inst88_data), .Z(inst472_z));
  CMPX #(.size(10)) inst81 (.A(inst472_z), .B(X), .ls(inst81_ls));  // open: eq, gr
  CMPX #(.size(10)) inst92 (.A(inst474_z), .B(X), .ls(inst92_ls));  // open: eq, gr
  ADD inst476 (.A(X_LEVIKRAJ), .B(inst110_data), .Z(inst476_z));
  CMPX #(.size(10)) inst103 (.A(inst476_z), .B(X), .ls(inst103_ls));  // open: eq, gr
  ADD inst478 (.A(X_LEVIKRAJ), .B(inst122_data), .Z(inst478_z));
  ADD inst480 (.A(X_LEVIKRAJ), .B(inst133_data), .Z(inst480_z));
  CMPX #(.size(10)) inst155 (.A(inst484_z), .B(X), .ls(inst155_ls), .eq(inst155_eq));  // open: gr
  or inst378 (inst378_out, inst155_eq, inst155_ls);
  or inst398 (inst398_out, inst200_eq, inst200_ls);
  or inst400 (inst400_out, inst207_eq, inst207_ls);
  or inst404 (inst404_out, inst214_eq, inst214_ls);
  or inst410 (inst410_out, inst227_eq, inst227_ls);
  and inst230 (level19x, inst411_out, inst410_out);
  and inst237 (level20x, inst413_out, inst412_out);
  or inst426 (inst426_out, inst242_eq, inst242_gr);
  and inst244 (level21x, inst426_out, inst425_out);
  and inst270 (level22x, inst430_out, inst429_out);
  or inst432 (inst432_out, inst275_eq, inst275_gr);
  and inst277 (level23x, inst432_out, inst431_out);
  and inst284 (level24x, inst436_out, inst435_out);
  and inst291 (level25x, inst440_out, inst439_out);
  or inst444 (inst444_out, inst296_eq, inst296_gr);
  and inst298 (level26x, inst444_out, inst443_out);
  or inst447 (inst447_out, inst302_eq, inst302_ls);
  and inst305 (level27x, inst448_out, inst447_out);
  or inst451 (inst451_out, inst310_eq, inst310_ls);
  and inst313 (level28x, inst452_out, inst451_out);
  and inst324 (level29x, inst456_out, inst455_out);
  or inst459 (inst459_out, inst332_eq, inst332_ls);
  and inst335 (level30x, inst460_out, inst459_out);
  CONSTX #(.size(10), .\const (82)) inst25 (.data(inst25_data));
  and inst10 (valid, xok, yok);
  CMPX #(.size(10)) inst114 (.A(inst478_z), .B(X), .ls(inst114_ls));  // open: eq, gr
  CMPX #(.size(10)) inst126 (.A(inst480_z), .B(X), .ls(inst126_ls));  // open: eq, gr
  ADD inst482 (.A(X_LEVIKRAJ), .B(inst144_data), .Z(inst482_z));
  CMPX #(.size(10)) inst137 (.A(inst482_z), .B(X), .ls(inst137_ls));  // open: eq, gr
  or inst386 (inst386_out, inst173_eq, inst173_ls);
  and inst185 (level14x, inst391_out, inst390_out);
  or inst392 (inst392_out, inst189_eq, inst189_ls);
  and inst192 (level15x, inst393_out, inst392_out);
  and inst203 (level16x, inst399_out, inst398_out);
  or inst401 (inst401_out, inst208_eq, inst208_gr);
  and inst210 (level17x, inst401_out, inst400_out);
  or inst405 (inst405_out, inst215_eq, inst215_gr);
  and inst217 (level18x, inst405_out, inst404_out);
  CONSTX #(.size(10), .\const (78)) inst255 (.data(inst255_data));
  or inst411 (inst411_out, inst228_eq, inst228_gr);
  CONSTX #(.size(10), .\const (80)) inst253 (.data(inst253_data));
  or inst413 (inst413_out, inst235_eq, inst235_gr);
  CONSTX #(.size(10), .\const (76)) inst347 (.data(inst347_data));
  CONSTX #(.size(10), .\const (72)) inst349 (.data(inst349_data));
  or inst430 (inst430_out, inst268_eq, inst268_gr);
  CONSTX #(.size(10), .\const (68)) inst351 (.data(inst351_data));
  CONSTX #(.size(10), .\const (64)) inst353 (.data(inst353_data));
  or inst436 (inst436_out, inst282_eq, inst282_gr);
  or inst440 (inst440_out, inst289_gr, inst289_eq);
  CONSTX #(.size(10), .\const (56)) inst357 (.data(inst357_data));
  CONSTX #(.size(10), .\const (52)) inst359 (.data(inst359_data));
  or inst448 (inst448_out, inst303_eq, inst303_gr);
  CONSTX #(.size(10), .\const (48)) inst361 (.data(inst361_data));
  or inst452 (inst452_out, inst311_eq, inst311_gr);
  or inst456 (inst456_out, inst322_eq, inst322_gr);
  or inst460 (inst460_out, inst333_eq, inst333_gr);
  and inst167 (level12x, inst381_out, inst383_out);
  or inst387 (inst387_out, inst174_eq, inst174_gr);
  and inst176 (level13x, inst387_out, inst386_out);
  or inst393 (inst393_out, inst190_eq, inst190_gr);
  CONSTX #(.size(10), .\const (72)) inst263 (.data(inst263_data));
  CONSTX #(.size(10), .\const (74)) inst264 (.data(inst264_data));
  CONSTX #(.size(10), .\const (76)) inst257 (.data(inst257_data));
  ADD inst509 (.A(X_LEVIKRAJ), .B(inst351_data), .Z(inst509_z));
  CONSTX #(.size(10), .\const (60)) inst355 (.data(inst355_data));
  CONSTX #(.size(10), .\const (44)) inst363 (.data(inst363_data));
  CONSTX #(.size(10), .\const (41)) inst365 (.data(inst365_data));
  CLK_DIVIDER #(.period_InMHz(50), .period_OutMiliSec(4)) inst12 (.in_clk(CLK), .out_clk(inst12_out_clk));
  and inst59 (level2x, inst44_gr, inst43_ls);
  and inst66 (level3x, inst48_gr, inst47_ls);
  CONSTX #(.size(10), .\const (48)) inst78 (.data(inst78_data));
  and inst73 (level4x, inst71_gr, inst70_ls);
  and inst95 (level6x, inst93_gr, inst92_ls);
  and inst158 (level11x, inst379_out, inst378_out);
  CONSTX #(.size(10), .\const (64)) inst259 (.data(inst259_data));
  or inst381 (inst381_out, inst165_eq, inst165_gr);
  CONSTX #(.size(10), .\const (66)) inst260 (.data(inst260_data));
  CONSTX #(.size(10), .\const (68)) inst261 (.data(inst261_data));
  or inst391 (inst391_out, inst183_eq, inst183_gr);
  CONSTX #(.size(10), .\const (70)) inst262 (.data(inst262_data));
  or inst399 (inst399_out, inst201_eq, inst201_gr);
  ADD inst497 (.A(X_LEVIKRAJ), .B(inst264_data), .Z(inst497_z));
  ADD inst499 (.A(X_LEVIKRAJ), .B(inst257_data), .Z(inst499_z));
  CMPX #(.size(10)) inst215 (.A(inst499_z), .B(X), .eq(inst215_eq), .gr(inst215_gr));  // open: ls
  ADD inst501 (.A(X_LEVIKRAJ), .B(inst255_data), .Z(inst501_z));
  CMPX #(.size(10)) inst228 (.A(inst501_z), .B(X), .eq(inst228_eq), .gr(inst228_gr));  // open: ls
  ADD inst503 (.A(X_LEVIKRAJ), .B(inst253_data), .Z(inst503_z));
  CMPX #(.size(10)) inst235 (.A(inst503_z), .B(X), .eq(inst235_eq), .gr(inst235_gr));  // open: ls
  ADD inst505 (.A(X_LEVIKRAJ), .B(inst347_data), .Z(inst505_z));
  CMPX #(.size(10)) inst242 (.A(inst505_z), .B(X), .eq(inst242_eq), .gr(inst242_gr));  // open: ls
  ADD inst507 (.A(X_LEVIKRAJ), .B(inst349_data), .Z(inst507_z));
  CMPX #(.size(10)) inst268 (.A(inst507_z), .B(X), .eq(inst268_eq), .gr(inst268_gr));  // open: ls
  CMPX #(.size(10)) inst275 (.A(inst509_z), .B(X), .eq(inst275_eq), .gr(inst275_gr));  // open: ls
  ADD inst511 (.A(X_LEVIKRAJ), .B(inst353_data), .Z(inst511_z));
  CMPX #(.size(10)) inst282 (.A(inst511_z), .B(X), .eq(inst282_eq), .gr(inst282_gr));  // open: ls
  ADD inst513 (.A(X_LEVIKRAJ), .B(inst355_data), .Z(inst513_z));
  CMPX #(.size(10)) inst289 (.A(inst513_z), .B(X), .eq(inst289_eq), .gr(inst289_gr));  // open: ls
  ADD inst515 (.A(X_LEVIKRAJ), .B(inst357_data), .Z(inst515_z));
  CMPX #(.size(10)) inst296 (.A(inst515_z), .B(X), .eq(inst296_eq), .gr(inst296_gr));  // open: ls
  ADD inst517 (.A(X_LEVIKRAJ), .B(inst359_data), .Z(inst517_z));
  CMPX #(.size(10)) inst303 (.A(inst517_z), .B(X), .eq(inst303_eq), .gr(inst303_gr));  // open: ls
  ADD inst519 (.A(X_LEVIKRAJ), .B(inst361_data), .Z(inst519_z));
  CMPX #(.size(10)) inst311 (.A(inst519_z), .B(X), .eq(inst311_eq), .gr(inst311_gr));  // open: ls
  ADD inst521 (.A(X_LEVIKRAJ), .B(inst363_data), .Z(inst521_z));
  CMPX #(.size(10)) inst322 (.A(inst521_z), .B(X), .eq(inst322_eq), .gr(inst322_gr));  // open: ls
  ADD inst523 (.A(X_LEVIKRAJ), .B(inst365_data), .Z(inst523_z));
  CMPX #(.size(10)) inst333 (.A(inst523_z), .B(X), .eq(inst333_eq), .gr(inst333_gr));  // open: ls
  and inst52 (level1x, inst40_gr, inst39_ls);
  CONSTX #(.size(10), .\const (46)) inst64 (.data(inst64_data));
  and inst84 (level5x, inst82_gr, inst81_ls);
  and inst106 (level7x, inst104_gr, inst103_ls);
  and inst117 (level8x, inst115_gr, inst114_ls);
  and inst129 (level9x, inst127_gr, inst126_ls);
  ADD inst487 (.A(X_LEVIKRAJ), .B(inst259_data), .Z(inst487_z));
  ADD inst489 (.A(X_LEVIKRAJ), .B(inst260_data), .Z(inst489_z));
  ADD inst491 (.A(X_LEVIKRAJ), .B(inst261_data), .Z(inst491_z));
  CMPX #(.size(10)) inst183 (.A(inst491_z), .B(X), .eq(inst183_eq), .gr(inst183_gr));  // open: ls
  ADD inst493 (.A(X_LEVIKRAJ), .B(inst262_data), .Z(inst493_z));
  CMPX #(.size(10)) inst190 (.A(inst493_z), .B(X), .eq(inst190_eq), .gr(inst190_gr));  // open: ls
  ADD inst495 (.A(X_LEVIKRAJ), .B(inst263_data), .Z(inst495_z));
  CMPX #(.size(10)) inst201 (.A(inst495_z), .B(X), .eq(inst201_eq), .gr(inst201_gr));  // open: ls
  CMPX #(.size(10)) inst208 (.A(inst497_z), .B(X), .eq(inst208_eq), .gr(inst208_gr));  // open: ls
  and inst19 (lev, incc, BUTTON_LEVO, inst532_eq);
  and inst17 (desn, BUTTON_DESNO, incc, inst532_eq);
  CONSTX #(.size(10), .\const (42)) inst51 (.data(inst51_data));
  CONSTX #(.size(10), .\const (44)) inst57 (.data(inst57_data));
  ADD inst470 (.A(X_LEVIKRAJ), .B(inst64_data), .Z(inst470_z));
  ADD inst471 (.A(X_LEVIKRAJ), .B(inst78_data), .Z(inst471_z));
  CONSTX #(.size(10), .\const (50)) inst89 (.data(inst89_data));
  CONSTX #(.size(10), .\const (52)) inst100 (.data(inst100_data));
  CONSTX #(.size(10), .\const (54)) inst111 (.data(inst111_data));
  and inst140 (level10x, inst138_gr, inst137_ls);
  CONSTX #(.size(10), .\const (62)) inst258 (.data(inst258_data));
  CMPX #(.size(10)) inst165 (.A(inst487_z), .B(X), .eq(inst165_eq), .gr(inst165_gr));  // open: ls
  CMPX #(.size(10)) inst174 (.A(inst489_z), .B(X), .eq(inst174_eq), .gr(inst174_gr));  // open: ls
  CMPX #(.size(10)) inst28 (.A(X_LEVIKRAJ), .B(inst30_data), .eq(inst28_eq));  // open: ls, gr
  ADD inst469 (.A(X_LEVIKRAJ), .B(inst57_data), .Z(inst469_z));
  CMPX #(.size(10)) inst44 (.A(inst469_z), .B(X), .gr(inst44_gr));  // open: ls, eq
  CMPX #(.size(10)) inst48 (.A(inst470_z), .B(X), .gr(inst48_gr));  // open: ls, eq
  CMPX #(.size(10)) inst71 (.A(inst471_z), .B(X), .gr(inst71_gr));  // open: ls, eq
  ADD inst475 (.A(X_LEVIKRAJ), .B(inst100_data), .Z(inst475_z));
  CMPX #(.size(10)) inst93 (.A(inst475_z), .B(X), .gr(inst93_gr));  // open: ls, eq
  ADD inst477 (.A(X_LEVIKRAJ), .B(inst111_data), .Z(inst477_z));
  CONSTX #(.size(10), .\const (56)) inst123 (.data(inst123_data));
  CONSTX #(.size(10), .\const (58)) inst134 (.data(inst134_data));
  CONSTX #(.size(10), .\const (60)) inst145 (.data(inst145_data));
  ADD inst485 (.A(X_LEVIKRAJ), .B(inst258_data), .Z(inst485_z));
  CMPX #(.size(10)) inst156 (.A(inst485_z), .B(X), .eq(inst156_eq), .gr(inst156_gr));  // open: ls
  ADD inst525 (.A(X_LEVIKRAJ), .B(inst51_data), .Z(inst525_z));
  CMPX #(.size(10)) inst40 (.A(inst525_z), .B(X), .gr(inst40_gr));  // open: ls, eq
  ADD inst473 (.A(X_LEVIKRAJ), .B(inst89_data), .Z(inst473_z));
  CMPX #(.size(10)) inst82 (.A(inst473_z), .B(X), .gr(inst82_gr));  // open: ls, eq
  CMPX #(.size(10)) inst104 (.A(inst477_z), .B(X), .gr(inst104_gr));  // open: ls, eq
  ADD inst479 (.A(X_LEVIKRAJ), .B(inst123_data), .Z(inst479_z));
  CMPX #(.size(10)) inst115 (.A(inst479_z), .B(X), .gr(inst115_gr));  // open: ls, eq
  ADD inst481 (.A(X_LEVIKRAJ), .B(inst134_data), .Z(inst481_z));
  CMPX #(.size(10)) inst127 (.A(inst481_z), .B(X), .gr(inst127_gr));  // open: ls, eq
  or inst379 (inst379_out, inst156_gr, inst156_eq);
  DFF inst13 (.CLK(CLK), .D(inst12_out_clk), .Q(inst13_q));  // open: CLRN, PRN
  CONSTX #(.size(10), .\const (1)) inst30 (.data(inst30_data));
  ADD inst483 (.A(X_LEVIKRAJ), .B(inst145_data), .Z(inst483_z));
  CMPX #(.size(10)) inst138 (.A(inst483_z), .B(X), .gr(inst138_gr));  // open: ls, eq
  CMPX #(.size(10)) inst33 (.A(x2), .B(inst34_data), .eq(mx0));  // open: ls, gr
  DFF inst14 (.CLK(CLK), .D(inst13_q), .Q(inst14_q));  // open: CLRN, PRN
  or inst32 (ldx, inst29_eq, inst28_eq);
  CONSTX #(.size(10), .\const (800)) inst34 (.data(inst34_data));
  not inst15 (inst15_out, inst14_q);
  CMPX #(.size(10)) inst29 (.A(x2), .B(inst31_data), .eq(inst29_eq));  // open: ls, gr
  and inst16 (incc, inst13_q, inst15_out);
  CONSTX #(.size(4), .\const (2)) inst366 (.data(inst366_data));
  CONSTX #(.size(4), .\const (10)) inst367 (.data(inst367_data));
  CONSTX #(.size(4), .\const (13)) inst368 (.data(inst368_data));
  CONSTX #(.size(10), .\const (800)) inst31 (.data(inst31_data));
  CONSTX #(.size(4), .\const (0)) inst150 (.data(inst150_data));
  CONSTX #(.size(4), .\const (0)) inst151 (.data(inst151_data));
  CONSTX #(.size(4), .\const (0)) inst152 (.data(inst152_data));
  MP2X #(.size(4)) inst147 (.S(plava), .X0(inst150_data), .X1(inst366_data), .Y(inst147_y));
  MP2X #(.size(4)) inst148 (.S(plava), .X0(inst151_data), .X1(inst367_data), .Y(inst148_y));
  MP2X #(.size(4)) inst149 (.S(plava), .X0(inst152_data), .X1(inst368_data), .Y(inst149_y));
  or inst146 (plava, plava1, plava2, plava3, plava4, plava5, plava6, plava7, plava8, plava9, plava10, 1'b0, 1'b0);
  or inst369 (inst369_out, siva1, siva2, siva3, siva4, siva5, siva6, siva7, siva8, siva9, siva10, siva11, siva12);
  or inst372 (inst372_out, siva13, siva14, siva15, siva16, siva17, siva18, siva19, siva20);
  or inst373 (pin_name1, inst369_out, inst372_out);
  CONSTX #(.size(4), .\const (1)) inst463 (.data(inst463_data));
  MP2X #(.size(4)) inst376 (.S(pin_name1), .X0(inst147_y), .X1(inst463_data), .Y(R));
  CONSTX #(.size(4), .\const (14)) inst464 (.data(inst464_data));
  CONSTX #(.size(4), .\const (6)) inst465 (.data(inst465_data));
  MP2X #(.size(4)) inst370 (.S(pin_name1), .X0(inst148_y), .X1(inst464_data), .Y(G));
  MP2X #(.size(4)) inst371 (.S(pin_name1), .X0(inst149_y), .X1(inst465_data), .Y(B));

  // Other names for the same wires on the sheet: leftt = BUTTON_LEVO; rightt = BUTTON_DESNO; siva = pin_name1;
  //   x1[9:0] = X_LEVIKRAJ

  // Notes on the sheet:
  //   RISING_EDGE
  //   Odredjivanje granica (pozicije) kvadrata na X osi
  //   Ako se trenutni iscrtavajuci pixel nalazi u zadatim
  //    granicama, potrebno je iscrti pixel bojom kvadrata (valid=1)
  //   Odredjivanje granica (pozicije) kvadrata na Y osi
  //   Inkrementiranjem granica, dobija se efekat animacije (kvadrat se pomera po Y osi)
  //   Napomena:
  //   Inkrementiranjem granica Y ose vise od iscrtavajuceg dela ekrana (po verticali),
  //   Deo trupa za brodic
  //   Suzavanje:
endmodule
